# Altium schematic sheet PreAmp.SchDoc
size A4; SheetNumber: 2; SheetTotal: 5
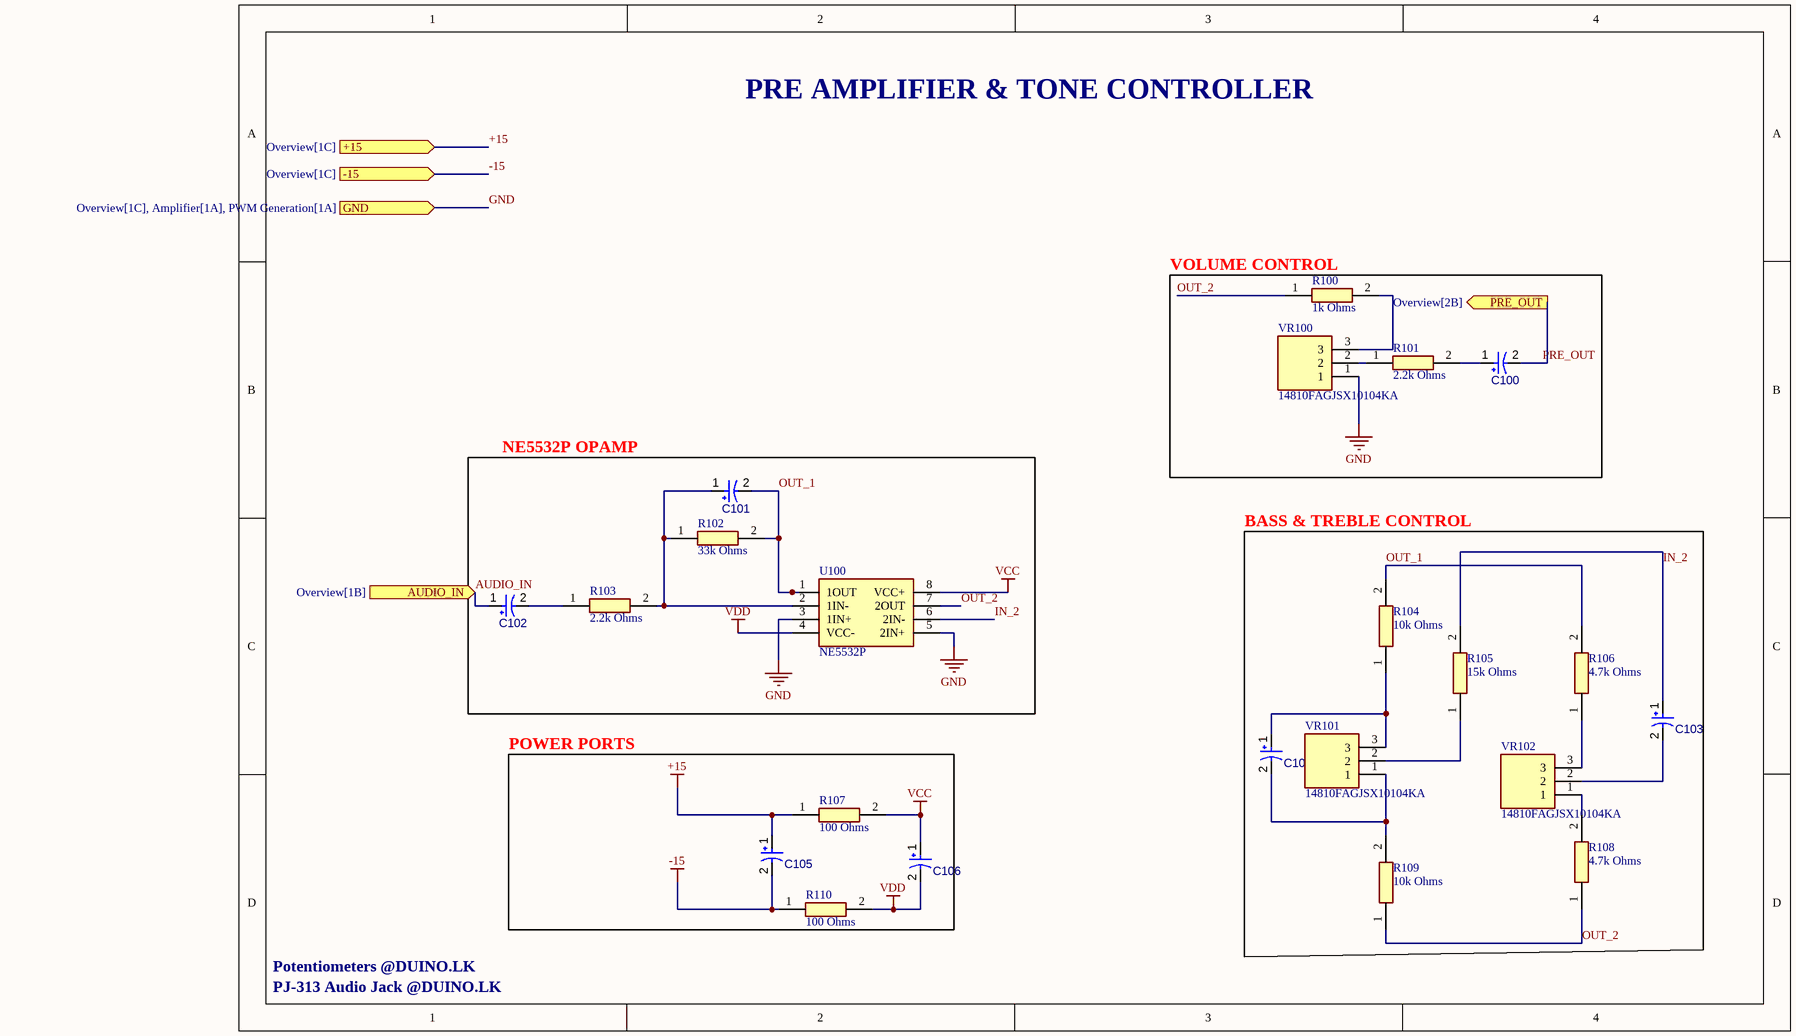
[diagram p0: PreAmp.SchDoc]

## Parts
C100  10uF  [CAPPR65-500-1600X1000X1700]  (value not drawn)
C101  47pF  [CAPPR65-500-1600X1000X1700]  (value not drawn)
C102  10uF  [CAPPR65-500-1600X1000X1700]  (value not drawn)
C103  2.2nF  [CAPPR65-500-1600X1000X1700]  (value not drawn)
C104  47nF  [CAPPR65-500-1600X1000X1700]  (value not drawn)
C105  1000uF  [CAPPR65-500-1600X1000X1700]  (value not drawn)
C106  100nF  [CAPPR65-500-1600X1000X1700]  (value not drawn)
R100  1k Ohms  [RESAD1650W60L650D250]
R101  2.2k Ohms  [RESAD1650W60L650D250]
R102  33k Ohms  [RESAD1650W60L650D250]
R103  2.2k Ohms  [RESAD1650W60L650D250]
R104  10k Ohms  [RESAD1650W60L650D250]
R105  15k Ohms  [RESAD1650W60L650D250]
R106  4.7k Ohms  [RESAD1650W60L650D250]
R107  100 Ohms  [RESAD1650W60L650D250]
R108  4.7k Ohms  [RESAD1650W60L650D250]
R109  10k Ohms  [RESAD1650W60L650D250]
R110  100 Ohms  [RESAD1650W60L650D250]
U100  NE5532P  [DIP794W53P254L959H508Q8N]
VR100  14810FAGJSX10104KA  [14810FAGJSX10104KA]
VR101  14810FAGJSX10104KA  [14810FAGJSX10104KA]
VR102  14810FAGJSX10104KA  [14810FAGJSX10104KA]

## Blocks framed on the sheet
VOLUME CONTROL: C100 R100 R101 VR100
NE5532P OPAMP: C101 C102 R102 R103 U100
BASS & TREBLE CONTROL: C103 C104 R104-R106 R108 R109 VR101 VR102
POWER PORTS: C105 C106 R107 R110

## Ports
+15 (in, see Overview[1C]), -15 (in, see Overview[1C]), AUDIO_IN (in, see Overview[1B]), GND (in, see Overview[1C], Amplifier[1A], PWM Generation[1A]), PRE_OUT (out, see Overview[2B])

## Nets
+15: C105.1 R107.1 ; port +15
-15: C105.2 R110.1 ; port -15
GND: U100.3(1IN+) U100.5(2IN+) VR100.1 ; port GND
VCC: C106.1 R107.2 U100.8(VCC+)
VDD: C106.2 R110.2 U100.4(VCC-)
AUDIO_IN: C102.1 ; port AUDIO_IN
IN_2: C103.1 R105.2 U100.6(2IN-)
OUT_1: C101.2 R102.2 R104.2 R106.2 U100.1(1OUT)
OUT_2: R100.1 R108.1 R109.1 U100.7(2OUT)
PRE_OUT: C100.2 ; port PRE_OUT
NetC100_1: C100.1 R101.2
NetC101_1: C101.1 R102.1 R103.2 U100.2(1IN-)
NetC102_2: C102.2 R103.1
NetC103_2: C103.2 VR102.2
NetC104_1: C104.1 R104.1 VR101.3
NetC104_2: C104.2 R109.2 VR101.1
NetR100_2: R100.2 VR100.3
NetR101_1: R101.1 VR100.2
NetR105_1: R105.1 VR101.2
NetR106_1: R106.1 VR102.3
NetR108_2: R108.2 VR102.1

## Notes on the sheet
- PRE AMPLIFIER & TONE CONTROLLER
- Potentiometers @DUINO.LK
- PJ-313 Audio Jack @DUINO.LK

## Library data of the parts
C100-C106 = CMP-001-00034-7: Manufacturer: Panasonic; Capacitor Type: Electrolytic; Voltage Rating: 100V; Tolerance: 20%; Value: 100µF; Ripple Current: 350mA; Mounting Technology: TH; Case/Package: Radial; Pins: 2; RoHS Compliant: True; Min Operating Temperature: -40°C; Max Operating Temperature: 85°C; Ripple Current (AC): 350mA; Package Quantity: 200; Package Description: 2-Pin Through Hole Device, Dia 10 mm, Body Length 16 mm; Package Reference: CAPPR65-500-1600X1000X1700; Datasheet URL: https://industrial.panasonic.com/cdbs/www-data/pdf/RDF0000/ABA0000C1047.pdf; Manufacturer URL: http://www.panasonic.com/; Packaging: Bulk; Datasheet Version: Mar-16; Diameter: 10mm; Lead Pitch: 5mm
R100-R110 = MRS25000C1052FCT00: Resistor; Manufacturer_Name: Vishay; Datasheet Link: http://www.vishay.com/docs/28724/mrs16m25.pdf; Manufacturer_Part_Number: MRS25000C1052FCT00; Mouser Part Number: 594-MRS25000C1052FCT; Mouser Price/Stock: https://www.mouser.co.uk/ProductDetail/Vishay-BC-Components/MRS25000C1052FCT00?qs=17u8i%2FzlE88YYQWf3OHpPg%3D%3D
U100 = NE5532P: Integrated Circuit; Manufacturer_Name: Texas Instruments; Datasheet Link: http://www.ti.com/lit/ds/symlink/ne5532a.pdf; Height: 5.08mm; Manufacturer_Part_Number: NE5532P; Mouser Part Number: 595-NE5532P; Mouser Price/Stock: https://www.mouser.co.uk/ProductDetail/Texas-Instruments/NE5532P?qs=3pnr37ZAbK%252Bre0OAHDmGsw%3D%3D; Arrow Part Number: NE5532P; Arrow Price/Stock: https://www.arrow.com/en/products/ne5532p/texas-instruments?region=nac
VR100-VR102 = 14810FAGJSX10104KA: Variable Resistor; Manufacturer_Name: Vishay; Datasheet Link: https://www.mouser.co.uk/datasheet/2/427/148149-239924.pdf; Height: 13.1mm; Manufacturer_Part_Number: 14810FAGJSX10104KA; Mouser Part Number: 594-148-7104; Mouser Price/Stock: https://www.mouser.co.uk/ProductDetail/Vishay-Spectrol/14810FAGJSX10104KA?qs=jxJUw0%2FAXLKQRjwLM10Vhg%3D%3D